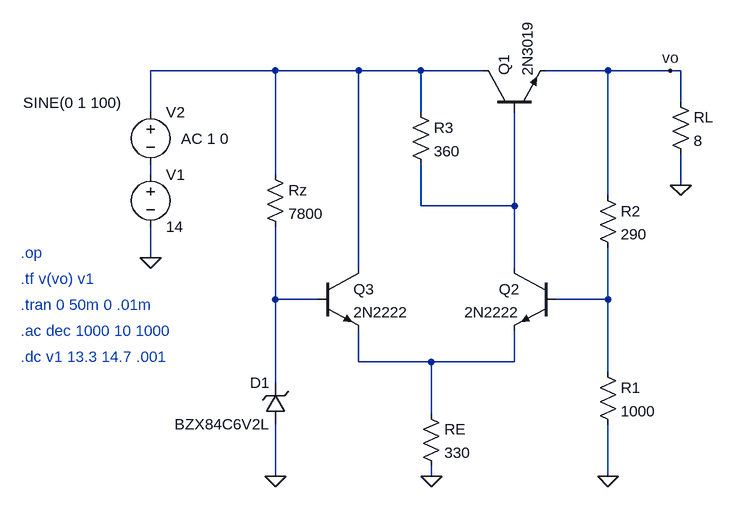
[diagram p0: schematic regulador.asc]
regulador.asc, the LTspice schematic file:
Version 4
SHEET 1 980 680
WIRE 224 -48 32 -48
WIRE 352 -48 224 -48
WIRE 448 -48 352 -48
WIRE 544 -48 448 -48
WIRE 736 -48 640 -48
WIRE 832 -48 736 -48
WIRE 848 -48 832 -48
WIRE 848 0 848 -48
WIRE 32 16 32 -48
WIRE 448 16 448 -48
WIRE 32 112 32 96
WIRE 224 112 224 -48
WIRE 848 128 848 80
WIRE 736 144 736 -48
WIRE 448 160 448 96
WIRE 592 160 592 16
WIRE 592 160 448 160
WIRE 32 240 32 192
WIRE 352 256 352 -48
WIRE 592 256 592 160
WIRE 224 304 224 192
WIRE 288 304 224 304
WIRE 736 304 736 224
WIRE 736 304 656 304
WIRE 352 400 352 352
WIRE 464 400 352 400
WIRE 592 400 592 352
WIRE 592 400 464 400
WIRE 736 416 736 304
WIRE 224 432 224 304
WIRE 464 480 464 400
WIRE 224 576 224 496
WIRE 464 576 464 560
WIRE 736 576 736 496
FLAG 32 240 0
FLAG 464 576 0
FLAG 224 576 0
FLAG 736 576 0
FLAG 848 128 0
FLAG 832 -48 vo
DATAFLAG 736 -48 ""
DATAFLAG 448 -48 ""
DATAFLAG 592 160 ""
DATAFLAG 464 400 ""
DATAFLAG 736 304 ""
DATAFLAG 224 304 ""
SYMBOL voltage 32 96 R0
WINDOW 123 0 0 Left 2
WINDOW 39 0 0 Left 2
SYMATTR InstName V1
SYMATTR Value 14
SYMBOL voltage 32 0 R0
WINDOW 123 47 57 Left 2
WINDOW 39 0 0 Left 2
WINDOW 3 -196 1 Left 2
SYMATTR Value2 AC 1 0
SYMATTR Value SINE(0 1 100)
SYMATTR InstName V2
SYMBOL npn 544 16 R270
SYMATTR InstName Q1
SYMATTR Value 2N3019
SYMBOL npn 288 256 R0
SYMATTR InstName Q3
SYMATTR Value 2N2222
SYMBOL npn 656 256 M0
SYMATTR InstName Q2
SYMATTR Value 2N2222
SYMBOL res 432 0 R0
SYMATTR InstName R3
SYMATTR Value 360
SYMBOL res 448 464 R0
SYMATTR InstName RE
SYMATTR Value 330
SYMBOL res 208 96 R0
SYMATTR InstName Rz
SYMATTR Value 7800
SYMBOL zener 240 496 R180
WINDOW 0 24 64 Left 2
WINDOW 3 24 0 Left 2
SYMATTR InstName D1
SYMATTR Value BZX84C6V2L
SYMATTR Description Diode
SYMATTR Type diode
SYMBOL res 720 128 R0
SYMATTR InstName R2
SYMATTR Value 290
SYMBOL res 720 400 R0
SYMATTR InstName R1
SYMATTR Value 1000
SYMBOL res 832 -16 R0
SYMATTR InstName RL
SYMATTR Value 8
TEXT -168 232 Left 2 ;.op
TEXT -168 312 Left 2 ;.tran 0 50m 0 .01m
TEXT -168 272 Left 2 ;.tf v(vo) v1
TEXT -168 352 Left 2 ;.ac dec 1000 10 1000
TEXT -168 392 Left 2 ;.dc v1 13.3 14.7 .001

The netlist it stands for:
* regulador.asc
V1 N002 0 14
V2 N001 N002 SINE(0 1 100) AC 1 0
Q1 N001 N003 vo 0 2N3019
Q3 N001 N004 N006 0 2N2222
Q2 N003 N005 N006 0 2N2222
R3 N001 N003 360
RE N006 0 330
Rz N001 N004 7800
D1 0 N004 BZX84C6V2L
R2 vo N005 290
R1 N005 0 1000
RL vo 0 8
.model D D
.lib standard.dio
.model NPN NPN
.model PNP PNP
.lib standard.bjt
* .op
* .tran 0 50m 0 .01m
* .tf v(vo) v1
* .ac dec 1000 10 1000
* .dc v1 13.3 14.7 .001
.backanno
.end